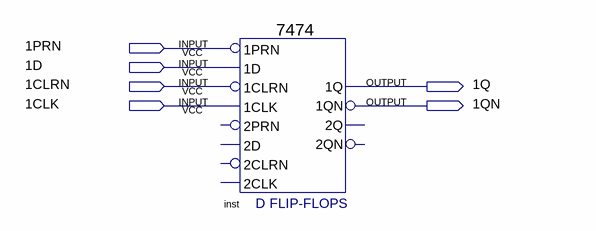
[diagram p0: schematic sheet]
// Quartus schematic exp3_2_2.bdf as structural Verilog: 1 symbols, 6 pins
module exp3_2_2 (
  input  \1PRN ,
  input  \1D ,
  input  \1CLRN ,
  input  \1CLK ,
  output \1Q ,
  output \1QN 
);

  \7474  inst (
    .\1CLK (\1CLK ), .\1D (\1D ), .\1PRN (\1PRN ), .\1CLRN (\1CLRN ), .\1QN (\1QN ), .\1Q (\1Q ));  // open: 2D, 2PRN, 2CLK, 2CLRN, 2Q, 2QN
endmodule
